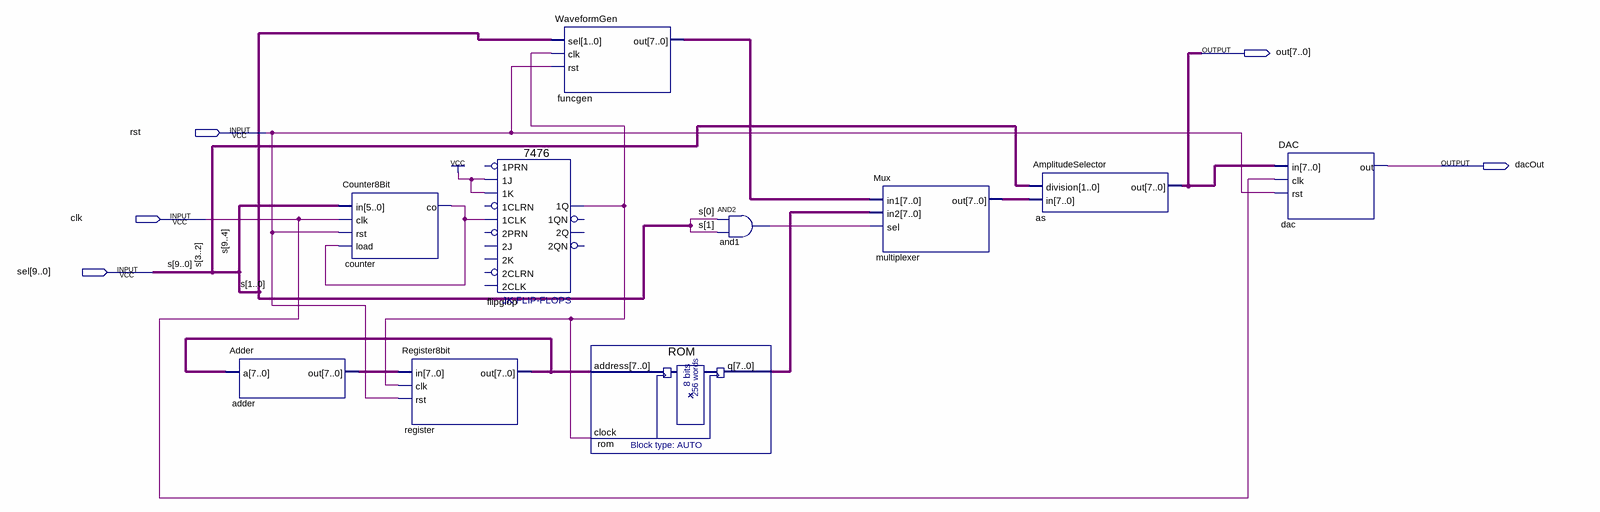
[diagram p0: schematic sheet]
// Quartus schematic FunctionGenerator.bdf as structural Verilog: 10 symbols, 5 pins
module FunctionGenerator (
  input  rst,
  input  clk,
  input  [9:0] sel,
  output [7:0] out,
  output dacOut
);

  wire and1_out, counter_co, flipglop_1q;
  wire [7:0] adder_out, funcgen_out, multiplexer_out, register_out, rom_q;

  Adder adder (.a(register_out), .out(adder_out));
  Counter8Bit counter (.in(sel[9:4]), .clk(clk), .rst(rst), .load(counter_co), .co(counter_co));
  Register8bit register (.in(adder_out), .clk(flipglop_1q), .rst(rst), .out(register_out));
  \7476  flipglop (
    .\1J (1'b1), .\1K (1'b1), .\1CLK (counter_co), .\1Q (flipglop_1q));  // open: 1PRN, 2PRN, 2J, 1CLRN, 2K, 2CLRN, 2CLK, 2QN, 2Q, 1QN
  WaveformGen funcgen (.sel(sel[1:0]), .clk(flipglop_1q), .rst(rst), .out(funcgen_out));
  ROM rom (.address(register_out), .clock(flipglop_1q), .q(rom_q));
  and and1 (and1_out, sel[0], sel[1]);
  Mux multiplexer (.in1(funcgen_out), .in2(rom_q), .sel(and1_out), .out(multiplexer_out));
  AmplitudeSelector as (.division(sel[3:2]), .in(multiplexer_out), .out(out));
  DAC dac (.in(out), .clk(clk), .rst(rst), .out(dacOut));

  // Other names for the same wires on the sheet: s[9:0] = sel
endmodule
